# EasyEDA Pro project ProPrj_PomoDesk_V1.0.epro, board PCB_V1.0
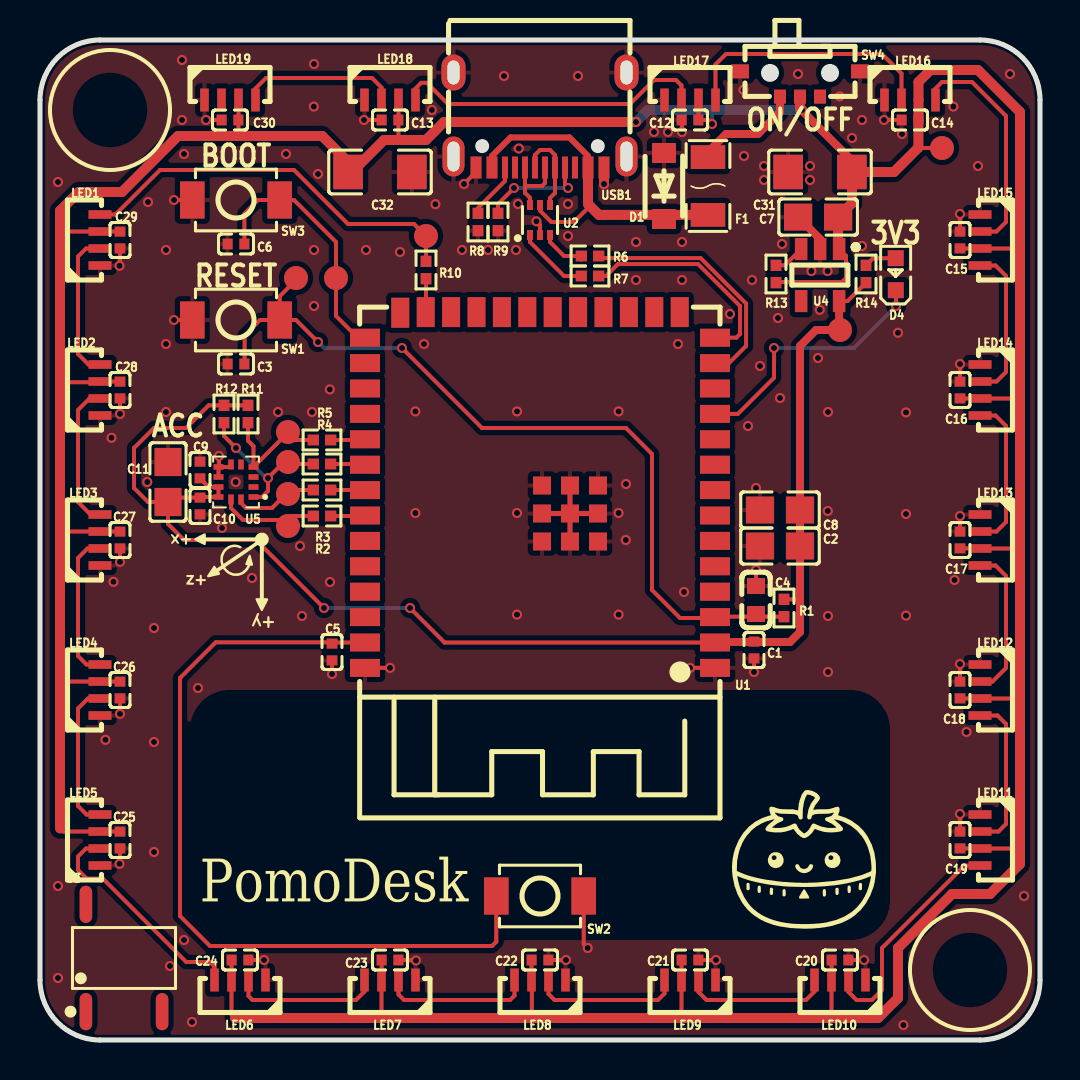
[diagram p7: board, top side]
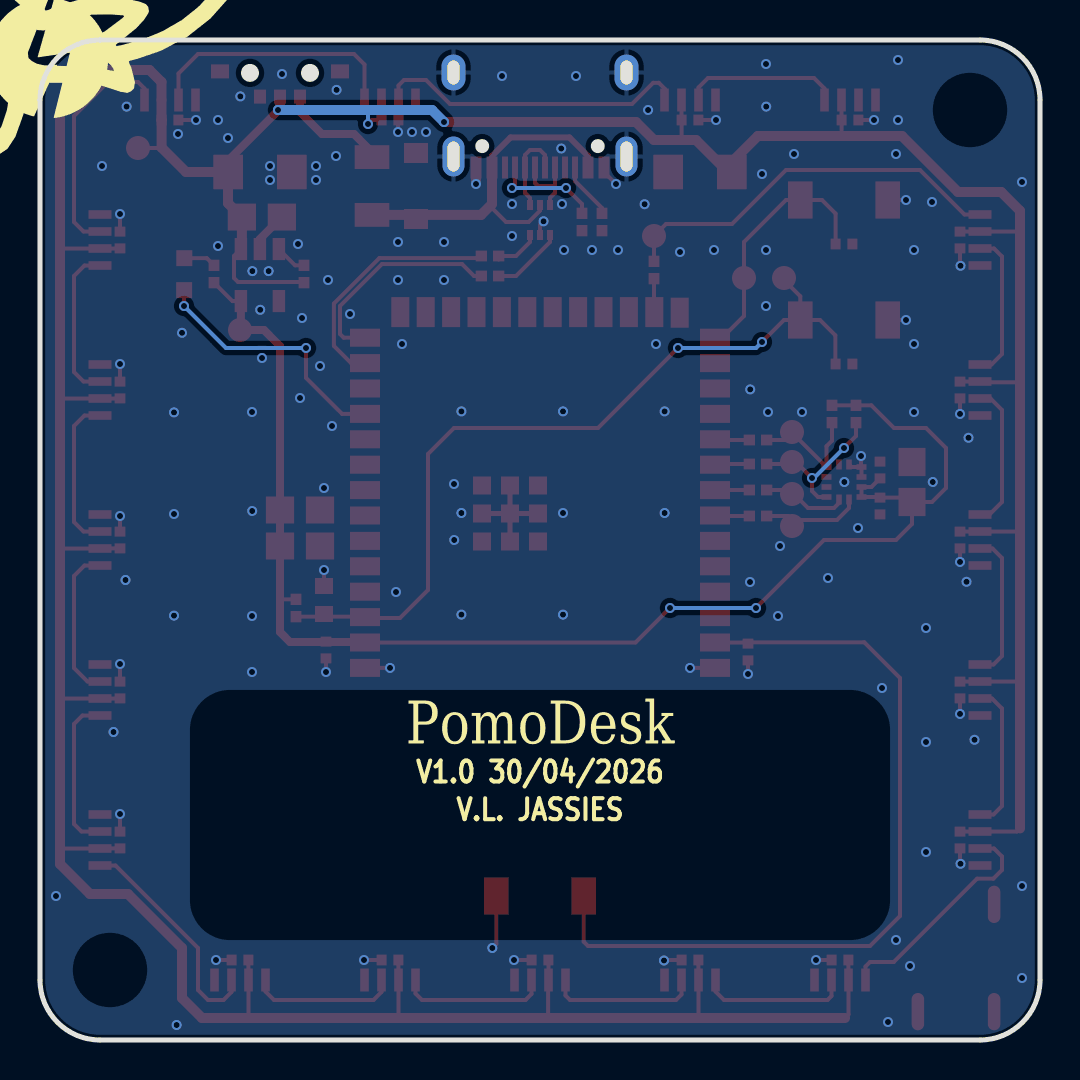
[diagram p8: board, bottom side, seen from below]

Outline 50 x 50 mm; copper layers: Top Layer, Bottom Layer. Coordinates in mm from the lower left corner of the outline.
Outline path: 0,47 0,3 arc(0.88,0.88) 3,0 47,0 arc(49.12,0.88) 50,3 50,47 arc(49.12,49.12) 47,50 3,50 arc(0.88,49.12) 0,47
Stack: Top Layer 0.035mm / Dielectric1 1.51mm FR4 er 4.5 / Bottom Layer 0.035mm

## Design rules (mm)
template: JLCPCB Capability(Two Layers Board)
spacing copperThickness1oz (default): track to track 0.102, other pairs 0.152 to 0.3
spacing copperThickness2oz: track to track 0.203, other pairs 0.152 to 0.3
track width copperThickness1oz (default): min 0.127, default 0.254, max 2.54
track width copperThickness2oz: min 0.203, default 0.254, max 2.54
differential pair differentialPair (default): width min 0.127, default 0.254, max 2.54; gap min 0.152, default 0.152
via viaSize (default): diameter min 0.5, default 0.61, max 10; hole min 0.3, default 0.305, max 6.3

## Placement (name value [footprint] x y rotation side)
C1  100nF  [C0402]  35.7 19.5 90 top
C2  10uF  [C0805]  37 24.7 0 top
C3  100nF  [C0402]  9.8 33.8 0 top
C4  1uF  [C0603]  35.8 22 270 top
C5  100nF  [C0402]  14.6 19.4 90 top
C6  100nF  [C0402]  9.8 39.8 0 top
C7  10uF  [C0805]  38.91 41.15 0 top
C8  10uF  [C0805]  37 26.5 0 top
C9  100nF  [C0402]  8 28.5 270 top
C10  100nF  [C0402]  8 26.7 90 top
C11  10uF  [C0805]  6.4 27.9 270 top
C12  100nF  [C0402]  32.5 46 0 top
C13  100nF  [C0402]  17.5 46 0 top
C14  100nF  [C0402]  43.5 46 0 top
C15  100nF  [C0402]  46 40 270 top
C16  100nF  [C0402]  46 32.5 270 top
C17  100nF  [C0402]  46 25 270 top
C18  100nF  [C0402]  46 17.5 270 top
C19  100nF  [C0402]  46 10 270 top
C20  100nF  [C0402]  40 4 180 top
C21  100nF  [C0402]  32.5 4 180 top
C22  100nF  [C0402]  25 4 180 top
C23  100nF  [C0402]  17.5 4 180 top
C24  100nF  [C0402]  10 4 180 top
C25  100nF  [C0402]  4 10 90 top
C26  100nF  [C0402]  4 17.5 90 top
C27  100nF  [C0402]  4 25 90 top
C28  100nF  [C0402]  4 32.5 90 top
C29  100nF  [C0402]  4 40 90 top
C30  100nF  [C0402]  9.5 46 0 top
C31  100uF  [C1206]  39 43.4 0 top
C32  100uF  [C1206]  17 43.4 180 top
D1  SMF5.0A  [SOD-123F_L2.8-W1.8-LS3.7-RD]  31.2 42.7 90 top
D4  GHC-YR1S2/6T  [LED0603-RD_GREEN]  42.79 38.29 90 top
F1  K1206L150AR  [F1206]  33.4 42.7 90 top
LED1  4020RGB-2812B  [LED-SMD_4P-L4.0-W1.7_XL-4020RGBC-WS2812B]  3 40 270 top
LED2  4020RGB-2812B  [LED-SMD_4P-L4.0-W1.7_XL-4020RGBC-WS2812B]  3 32.5 270 top
LED3  4020RGB-2812B  [LED-SMD_4P-L4.0-W1.7_XL-4020RGBC-WS2812B]  3 25 270 top
LED4  4020RGB-2812B  [LED-SMD_4P-L4.0-W1.7_XL-4020RGBC-WS2812B]  3 17.5 270 top
LED5  4020RGB-2812B  [LED-SMD_4P-L4.0-W1.7_XL-4020RGBC-WS2812B]  3 10 270 top
LED6  4020RGB-2812B  [LED-SMD_4P-L4.0-W1.7_XL-4020RGBC-WS2812B]  10 3 0 top
LED7  4020RGB-2812B  [LED-SMD_4P-L4.0-W1.7_XL-4020RGBC-WS2812B]  17.5 3 0 top
LED8  4020RGB-2812B  [LED-SMD_4P-L4.0-W1.7_XL-4020RGBC-WS2812B]  25 3 0 top
LED9  4020RGB-2812B  [LED-SMD_4P-L4.0-W1.7_XL-4020RGBC-WS2812B]  32.5 3 0 top
LED10  4020RGB-2812B  [LED-SMD_4P-L4.0-W1.7_XL-4020RGBC-WS2812B]  40 3 0 top
LED11  4020RGB-2812B  [LED-SMD_4P-L4.0-W1.7_XL-4020RGBC-WS2812B]  47 10 90 top
LED12  4020RGB-2812B  [LED-SMD_4P-L4.0-W1.7_XL-4020RGBC-WS2812B]  47 17.5 90 top
LED13  4020RGB-2812B  [LED-SMD_4P-L4.0-W1.7_XL-4020RGBC-WS2812B]  47 25 90 top
LED14  4020RGB-2812B  [LED-SMD_4P-L4.0-W1.7_XL-4020RGBC-WS2812B]  47 32.5 90 top
LED15  4020RGB-2812B  [LED-SMD_4P-L4.0-W1.7_XL-4020RGBC-WS2812B]  47 40 90 top
LED16  4020RGB-2812B  [LED-SMD_4P-L4.0-W1.7_XL-4020RGBC-WS2812B]  43.5 47 180 top
LED17  4020RGB-2812B  [LED-SMD_4P-L4.0-W1.7_XL-4020RGBC-WS2812B]  32.5 47 180 top
LED18  4020RGB-2812B  [LED-SMD_4P-L4.0-W1.7_XL-4020RGBC-WS2812B]  17.5 47 180 top
LED19  4020RGB-2812B  [LED-SMD_4P-L4.0-W1.7_XL-4020RGBC-WS2812B]  9.5 47 180 top
NOREF  -  [Pad_e10045]  12.4 27.3 0 top
NOREF#2  -  [Pad_e12603]  12.8 38.1 0 top
NOREF#3  -  [Pad_e12600]  14.8 38.1 0 top
NOREF#4  -  [Pad_e13775]  12.4 25.7 0 top
NOREF#5  -  [Pad_e11917]  19.3 40.2 0 top
NOREF#6  -  [Pad_e10046]  12.4 28.9 0 top
NOREF#7  -  [Pad_e9125]  45.1 44.6 270 top
NOREF#8  -  [Pad_e11690]  40 35.5 0 top
NOREF#9  -  [Pad_e10047]  12.4 30.4 0 top
R1  10kΩ  [R0402]  37.2 21.6 90 top
R2  0Ω  [R0402]  14.1 26.2 180 top
R3  0Ω  [R0402]  14.1 27.5 180 top
R4  0Ω  [R0402]  14.1 28.8 180 top
R5  0Ω  [R0402]  14.1 30 180 top
R6  22Ω  [R0402]  27.5 39.2 0 top
R7  22Ω  [R0402]  27.5 38.2 0 top
R8  5.1kΩ  [R0402]  21.9 40.9 90 top
R9  5.1kΩ  [R0402]  22.9 40.9 90 top
R10  220Ω  [R0402]  19.3 38.5 270 top
R11  10kΩ  [R0402]  10.4 31.3 90 top
R12  10kΩ  [R0402]  9.2 31.3 90 top
R13  10kΩ  [R0402]  36.8 38.3 270 top
R14  680Ω  [R0402]  41.3 38.3 270 top
SW1  TS-1088-AR02016  [SW-SMD_L3.9-W3.0-P4.45]  9.8 36 180 top
SW2  TS-1088-AR02016  [SW-SMD_L3.9-W3.0-P4.45]  25 7.2 0 top
SW3  TS-1088-AR02016  [SW-SMD_L3.9-W3.0-P4.45]  9.8 42 180 top
SW4  MK-11C04-G013  [SW-SMD_MK-11C04-G013]  38 47.8 180 top
U1  2.4GHz  [WIRELM-SMD_ESP32-S3-WROOM-1]  25 27.5 180 top
U2  USBLC6-2P6  [SOT-666-6_L1.6-W1.2-P0.50-LS1.6-BL]  25 41 0 top
U3  OC5022B  [ESOP-8_L4.9-W3.9-P1.27-LS6.0-BL-EP-1]  4.2 4.1 0 top
U4  AP2112K-3.3TRG1  [SOT-25-5_L2.9-W1.6-P0.95-LS2.8-BL]  39.01 38.25 180 top
U5  LIS2DW12TR  [LGA-12_L2.0-W2.0-P0.50-BL]  9.8 27.9 90 top
USB1  TYPE-C 16PIN 2MD(073)  [USB-C-SMD_TYPE-C-6PIN-2MD-073]  25 46 180 top

## Footprints (pads in the part's own frame, mm; a bottom-side part is the same pattern mirrored in y, then rotated)
C0402
  rect 0.5x0.54 smd: 1(-0.42,0) 2(0.42,0)
C0603
  rect 0.8x0.9 smd: 1(-0.7,0) 2(0.7,0)
C0805
  rect 1.41x1.35 smd: 1(-1,0) 2(1,0)
C1206
  rect 1.485x1.728 smd: 1(-1.593,0) 2(1.593,0)
ESOP-8_L4.9-W3.9-P1.27-LS6.0-BL-EP-1
  oval 0.63x1.865 smd: 1(-1.905,-2.683) 4(1.905,-2.683) 8(-1.905,2.683)
F1206
  rect 1.19x1.728 smd: 1(-1.445,0) 2(1.445,0)
LED0603-RD_GREEN
  rect 0.8x0.8 smd: 1(-0.799,-0.004) 2(0.799,0.004)
LED-SMD_4P-L4.0-W1.7_XL-4020RGBC-WS2812B
  rect 0.43x1.15 smd: 1(1.275,0) 2(0.425,0) 3(-0.425,0) 4(-1.275,0)
LGA-12_L2.0-W2.0-P0.50-BL
  rect 0.28x0.5 smd: 1(-0.75,-0.875) 2(-0.25,-0.875) 3(0.25,-0.875) 4(0.75,-0.875) 7(0.75,0.875) 8(0.25,0.875) 9(-0.25,0.875) 10(-0.75,0.875)
  rect 0.5x0.28 smd: 5(0.875,-0.25) 6(0.875,0.25) 11(-0.875,0.25) 12(-0.875,-0.25)
Pad_e9125
  round 1.2 smd: 1(0,0)
Pad_e10045
  round 1.2 smd: 1(0,0)
Pad_e10046
  round 1.2 smd: 1(0,0)
Pad_e10047
  round 1.2 smd: 1(0,0)
Pad_e11690
  round 1.2 smd: 1(0,0)
Pad_e11917
  round 1.2 smd: 1(0,0)
Pad_e12600
  round 1.2 smd: 1(0,0)
Pad_e12603
  round 1.2 smd: 1(0,0)
Pad_e13775
  round 1.2 smd: 1(0,0)
R0402
  rect 0.566x0.54 smd: 1(-0.433,0) 2(0.433,0)
SOD-123F_L2.8-W1.8-LS3.7-RD
  rect 1x1.2 smd: 1(-1.65,0) 2(1.65,0)
SOT-25-5_L2.9-W1.6-P0.95-LS2.8-BL
  rect 0.623x1.105 smd: 1(-0.95,-1.3) 2(-0.001,-1.3) 3(0.95,-1.3) 4(0.95,1.3) 5(-0.95,1.3)
SOT-666-6_L1.6-W1.2-P0.50-LS1.6-BL
  rect 0.3x0.5 smd: 1(-0.5,-0.75) 2(0,-0.75) 3(0.5,-0.75) 4(0.5,0.75) 5(0,0.75) 6(-0.5,0.75)
SW-SMD_L3.9-W3.0-P4.45
  rect 1.23x1.86 smd: 1(-2.185,0) 2(2.185,0)
SW-SMD_MK-11C04-G013
  rect 0.6x0.7 smd: 1(-1,0.63) 2(1,0.63) C(0,0.63)
  rect 0.9x0.7 smd: 4(3,-0.63) 5(-3,-0.63)
USB-C-SMD_TYPE-C-6PIN-2MD-073
  rect 0.55x1.1 smd: 1(-3.2,2.375) 2(-2.4,2.375) 11(2.4,2.375) 12(3.2,2.375)
  rect 0.3x1.1 smd: 3(-1.75,2.375) 4(-1.25,2.375) 5(-0.75,2.375) 6(-0.25,2.375) 7(0.25,2.375) 8(0.75,2.375) 9(1.25,2.375) 10(1.75,2.375)
  oval 1.1x2 hole 0.6x1.5: 13(-4.325,1.825) 14(4.325,1.825)
  oval 1.2x1.8 hole 0.6x1.2: 13(-4.325,-2.375) 14(4.325,-2.375)
WIRELM-SMD_ESP32-S3-WROOM-1
  rect 1.5x0.9 smd: 1(-8.75,8.895) 2(-8.75,7.625) 3(-8.75,6.355) 4(-8.75,5.085) 5(-8.75,3.815) 6(-8.75,2.545) 7(-8.75,1.275) 8(-8.75,0.005) 9(-8.75,-1.265) 10(-8.75,-2.535) 11(-8.75,-3.805) 12(-8.75,-5.075) 13(-8.75,-6.345) 14(-8.75,-7.615) 27(8.75,-7.615) 28(8.75,-6.345) 29(8.75,-5.075) 30(8.75,-3.805) 31(8.75,-2.535) 32(8.75,-1.265) 33(8.75,0.005) 34(8.75,1.275) 35(8.75,2.545) 36(8.75,3.815) 37(8.75,5.085) 38(8.75,6.355) 39(8.75,7.625) 40(8.75,8.895)
  rect 0.9x1.5 smd: 15(-6.985,-8.895) 16(-5.715,-8.895) 17(-4.445,-8.895) 18(-3.175,-8.895) 19(-1.905,-8.895) 20(-0.635,-8.895) 21(0.635,-8.895) 22(1.905,-8.895) 23(3.175,-8.895) 24(4.445,-8.895) 25(5.715,-8.895) 26(6.985,-8.865)
  rect 0.9x0.9 smd: 41(-2.9,2.575) 41(-2.9,1.175) 41(-2.9,-0.225) 41(-1.5,2.575) 41(-1.5,1.175) 41(-1.5,-0.225) 41(-0.1,2.575) 41(-0.1,1.175) 41(-0.1,-0.225)

## Nets
As in the schematic, except:
+3V3: C1.2 C2.2 C8.2 C9.2 C10.2 C11.2 NOREF#8.1 R1.2 R11.2 R12.2 R14.2 U1.2 U4.5 U5.9 U5.10
+5V: C7.2 C12.2 C13.2 C14.2 C15.2 C16.2 C17.2 C18.2 C19.2 C20.2 C21.2 C22.2 C23.2 C24.2 C25.2 C26.2 C27.2 C28.2 C29.2 C30.2 C31.2 C32.2 LED1.3 LED2.3 LED3.3 LED4.3 LED5.3 LED6.3 LED7.3 LED8.3 LED9.3 LED10.3 LED11.3 LED12.3 LED13.3 LED14.3 LED15.3 LED16.3 LED17.3 LED18.3 LED19.3 NOREF#7.1 R13.2 SW4.C U4.1
ACC_INT1: NOREF.1 R3.2 U5.12
ACC_INT2: NOREF#4.1 R2.2 U5.11
BOOT: C6.2 NOREF#3.1 SW3.1 U1.27
EN: C3.2 C4.2 NOREF#2.1 R1.1 SW1.1 U1.3
I2C_SCL: NOREF#6.1 R4.2 R12.1 U5.1
I2C_SDA: NOREF#9.1 R5.2 R11.1 U5.4
RGB_CTRL: LED1.4 NOREF#5.1 R10.1

Pads without a net: LED19 2; SW4 1; U1 4 5 6 7 8 9 10 12 15 16 17 18 19 20 21 22 23 24 26 28 29 30 35 36 37 38; U3 1 4 8; U4 4; U5 2 3 5; USB1 3 9

## Via types
v1: diameter 0.5, hole 0.305, Top Layer to Bottom Layer, 151 vias

## Routing (per net, layer and track width the routed paths; a pad name or vN(x,y) marks a point on that pad's centre or on a via; arc(x,y) is an arc through that point)
+3V3: length 70.8
  Top Layer w0.2: R1.2 38,22.03 38,22.03 ; C9.2 8.43,27.65 U5.9 U5.10 8.03,27.15 C10.2 6.62,27.12 C11.2 ; v1(14.2,21.6) 10.8,25 7.2,25 6.4,25.8 C11.2 ; R11.2 R12.2 8.43,31.73 7.3,30.6 5.7,30.6 4.7,29.6 4.7,27.6 5.4,26.9 C11.2 ; v1(18.5,21.6) 20.22,19.88 U1.2 ; U4.5 40.38,36.95 41.3,37.87
  Top Layer w0.4: U1.2 33.78,19.9 37.5,19.9 38,20.4 C2.2 C8.2 38,34.7 38.8,35.5 NOREF#8.1 39.96,35.54 U4.5
  Bottom Layer w0.2: v1(18.5,21.6) v1(14.2,21.6)
+5V: length 232.8
  Top Layer w0.2: C23.2 17.08,3 LED7.3 17.07,1.16 17.13,1.1 ; C25.2 4,10.42 LED5.3 1.16,10.42 1,10.58 ; 36.8,37.87 36.83,37.9 40.1,37.9 40.3,38.1 40.3,39.2 U4.1 ; 1,40.42 1,40.42 LED1.3 4,40.42 C29.2 ; 49,9.61 48.96,9.58 LED11.3 47,9.58 C19.2 ; 9.92,45.5 C30.2 9.93,46 LED19.3 ; C28.2 4,32.92 LED2.3 2.96,32.89 1,32.89 ; C27.2 4,25.42 LED3.3 1.07,25.42 1,25.5 ; C21.2 32.08,3 LED9.3 32.07,1.11 32.09,1.1 ; 24.59,1.1 24.59,2.98 LED8.3 24.57,4 C22.2 ; 49,32.09 48.99,32.08 LED14.3 46,32.08 C16.2 ; 39.61,1.1 39.57,1.13 LED10.3 39.58,3 C20.2 ; LED18.3 17.93,46 C13.2 17.92,45.08 17.84,45 ; 49,17.06 48.99,17.08 LED12.3 46,17.08 C18.2 ; 1,17.93 1.01,17.92 LED4.3 4,17.92 C26.2 ; NOREF#7.1 43.94,44.6 43.92,44.62 ; C17.2 47,24.58 LED13.3 49,24.58 ; 49,39.57 49,39.58 LED15.3 46,39.58 C15.2 ; v1(33.6,45.8) 33.4,46 C12.2 32.93,46 LED17.3 ; C24.2 9.58,3 LED6.3 9.57,1.27 9.75,1.1
  Top Layer w0.4: 38.06,46.5 40.6,43.97 40.6,43.35
  Top Layer w0.5: 39.96,39.65 39.91,39.7 C7.2 40.6,41.84 40.6,43.35 ; v1(29.8,45.9) 20.2,45.9 19.3,45 17.2,45 15.6,43.4 C32.2 15.41,43.9 14.11,45.2 6.9,45.2 4.1,42.4 1.94,42.4 1,41.46 1,10.58 ; v1(38.1,46.5) 38.06,46.5 38,46.56 SW4.C ; 40.6,43.4 42.7,43.4 43.92,44.62 C14.2 43.93,46 LED16.3 43.93,47.9 44.53,48.5 46.9,48.5 49,46.4 49,8.8 47.5,7.3 45.6,7.3 42.9,4.6 42.9,2.1 41.9,1.1 9.75,1.1
  Bottom Layer w0.2: 33.56,46.5 33.6,46.45 v1(33.6,45.8)
  Bottom Layer w0.5: v1(38.1,46.5) 30.4,46.5 v1(29.8,45.9)
GND: length 36.7
  Top Layer w0.2: U2.2 25,40.76 v1(24.82,40.93) ; C1.1 v1(35.7,18.4) ; C13.1 v1(16.2,46) ; C4.1 v1(35.8,23.5) ; 14.6,18.88 v1(14.6,18.3) ; U5.8 U5.7 ; U5.7 9.43,28.65 U5.6 ; U5.7 8.95,28.67 v1(8.95,29.2) ; v1(3.97,8.81) 4,8.83 C25.1 ; C26.1 v1(4,16.31) ; C27.1 v1(4,23.91) ; C30.1 v1(8.3,46) ; C19.1 v1(46,11.3) ; C12.1 32.1,45.98 v1(32.1,45.4) ; v1(18.8,3.97) 18.78,4 C23.1 ; C14.1 v1(42.2,46) ; C18.1 v1(46,18.8) ; U1.1 v1(32.5,18.61) ; v1(27.38,4.6) 27.19,4.8 SW2.2 ; USB1.12 21.8,43.4 v1(21.2,42.8) ; C24.1 v1(11.2,4) ; C29.1 4,38.73 v1(3.97,38.71) ; C17.1 v1(46,26.2) ; C20.1 v1(41.2,4) ; SW1.2 v1(6.7,36) ; C28.1 v1(4,31.31) ; SW3.2 v1(6.7,42) ; U1.40 v1(17.5,18.61) ; C15.1 v1(46,41.3) ; C22.1 v1(26.3,4) ; C16.1 v1(46,33.8) ; C21.1 v1(33.8,4)
  Top Layer w0.254: U1.41 U1.41 ; U1.41 U1.41 ; U1.41 U1.41 ; U1.41 U1.41
  Top Layer w0.4: 39.01,39.55 39.01,40.05 C7.1
  Top Layer w0.5: USB1.1 v1(28.2,42.8)
  vias: v1(0.9,42.9) v1(0.9,7.7) v1(0.9,3.1) v1(3.28,15.01) v1(3.58,30.11) v1(3.67,22.91) v1(5.4,41.9) v1(5.36,27.9) v1(5.7,20.6) v1(5.7,14.9) v1(5.7,9.4) v1(6.3,39.5) v1(6.3,34.8) v1(6.3,31.4) v1(6.5,3.7) v1(7.1,49) v1(7.1,46) v1(7.2,44.3) v1(7.2,5) v1(7.6,0.9) v1(7.9,17.6) v1(9.1,25.6) v1(9.78,27.9) v1(10.6,23.1) v1(11.9,31.4) v1(12.3,44.3) v1(13,24.7) v1(13.1,21.2) v1(13.6,31.4) v1(13.7,48.8) v1(13.69,46.67) v1(13.7,39.5) v1(13.7,36.7) v1(13.9,43.3) v1(14.49,32.53) v1(14.5,22.9) v1(16.3,39.5) v1(18,39.4) v1(18.77,31.43) v1(18.77,26.35) v1(19.2,34.8) v1(19.59,46.5) v1(19.77,41.79) v1(21.1,39.5) v1(22.4,39.5) v1(23.2,48.2) v1(23.8,39.5) v1(23.85,31.43) v1(23.85,26.35) v1(23.85,21.27) v1(23.94,44.58) v1(23.9,41.8) v1(26.4,41.8) v1(26.4,40.2) v1(26.9,48.2) v1(28.93,31.43) v1(28.93,26.35) v1(28.93,21.27) v1(29.3,27.8) v1(29.29,25) v1(29.8,39.9) v1(29.8,38) v1(30.7,45.4) v1(31.4,45.4) v1(31.9,34.8) v1(32.1,39.9) v1(32.1,38) v1(32.2,22.4) v1(34.5,36.3) v1(35.17,47.5) v1(35.2,44.2) v1(35.4,30.7) v1(35.6,38) v1(35.8,27.6) v1(36,33.7) v1(36.2,43.7) v1(36.2,43) v1(36.9,36.1) v1(37,32.1) v1(37.1,39.8) v1(37.9,48.3) v1(38.5,43.7) v1(38.5,43) v1(38.57,38.45) v1(38.9,34.1) v1(38.99,36.51) v1(39.38,38.45) v1(39.4,31.4) v1(39.39,26.45) v1(39.4,21.2) v1(39.4,18.4) v1(39.98,47.18) v1(40.6,45.1) v1(41.1,46) v1(41.1,39.7) v1(42.9,35.36) v1(43.1,45.3) v1(43.17,0.75) v1(43.3,31.38) v1(43.3,26.3) v1(43.3,21.22) v1(45.67,46.67) v1(45.72,23) v1(46.32,15.4) v1(46.9,43.7) v1(48.5,48.3) v1(49.2,7.2)
VBUS: length 18.2
  Top Layer w0.2: U2.5 25,41.47 25.57,40.9 26.7,40.9 27.4,41.6 27.4,41.8
  Top Layer w0.3: USB1.11 22.6,44.2 23.53,45.13 26.47,45.13 27.4,44.2 USB1.2
  Top Layer w0.5: USB1.2 27.4,41.8 27.94,41.25 F1.1
VIN: length 5.5
  Top Layer w0.4: SW4.2 37,46.4 35.9,45.3 34.3,45.3 33.4,44.4 F1.2
ACC_INT1: length 4.3
  Top Layer w0.2: U5.12 10.05,26.85 10.3,26.6 11.6,26.6 12.5,27.5 R3.2
ACC_INT2: length 4.9
  Top Layer w0.2: U5.11 9.55,26.6 10.15,26 12.4,26 12.6,26.2 R2.2
BOOT: length 12.9
  Top Layer w0.2: C6.2 10.22,41.32 10.9,42 SW3.1 12.7,42 14.8,39.9 NOREF#3.1 14.8,36.2 15.88,35.11 U1.27
EN: length 41.4
  Top Layer w0.2: SW1.1 11.99,37.19 12.9,38.1 ; SW1.1 12.8,36 v1(13.9,34.9) ; SW1.1 11,36 10.23,35.23 10.23,33.8 ; v1(18.1,34.6) 22.1,30.6 29.3,30.6 30.6,29.3 30.6,22.5 32,21.1 33.71,21.1 U1.3 33.77,21.17 37.2,21.17
  Bottom Layer w0.2: v1(13.9,34.9) 14.2,34.6 v1(18.1,34.6)
I2C_SCL: length 7.8
  Top Layer w0.2: R4.2 12.1,28.8 v1(11.4,28.1) 11.4,27.45 11.1,27.15 U5.1 ; v1(9.8,29.6) 9.2,30.2 9.2,30.87
  Bottom Layer w0.2: v1(9.8,29.6) 11.3,28.1 v1(11.4,28.1)
I2C_SDA: length 6
  Top Layer w0.2: R5.2 12.6,30 12.4,30.2 12.22,30.2 U5.4 10.68,29.69 10.4,29.96 10.4,30.87
INPUT_BUTTON: length 40.8
  Top Layer w0.2: SW2.1 22.81,4.92 22.6,4.7 8.5,4.7 7,6.2 7,18.1 8.78,19.89 14.44,19.89 14.6,19.72 14.75,19.88 U1.39
PWR_LED: length 13
  Top Layer w0.2: v1(42.8,36.7) 42.8,37.48 D4.1 ; U1.11 34.9,31.31 36.7,33.11 36.7,33.79 36.7,33.79 36.7,34.21 36.7,34.21 v1(36.7,34.6)
  Bottom Layer w0.2: v1(36.7,34.6) 38.69,34.6 38.69,34.6 39.11,34.6 39.11,34.6 40.7,34.6 v1(42.8,36.7)
RGB_CTRL: length 19.9
  Top Layer w0.2: R10.1 NOREF#5.1 18.7,40.8 15.4,40.8 12.7,43.5 6,43.5 3.78,41.28 LED1.4
USB_D+: length 10.9
  Top Layer w0.2: R7.2 28.3,38.2 28.9,38.8 32.9,38.8 35,36.7 35,36.51 35,36.51 35,36.09 35,36.09 35,35.3 34.81,35.11 U1.14
USB_D-: length 12.4
  Top Layer w0.2: R6.2 27.93,39.2 28.03,39.1 33.03,39.1 35.3,36.82 35.3,34.7 34.44,33.84 U1.13
USB_DN: length 4.4
  Top Layer w0.2: U2.4 25.5,42.1 25.75,42.35 USB1.5 25.75,44.25 25.5,44.5 25,44.5 24.75,44.25 USB1.7
USB_DP: length 3.8
  Top Layer w0.2: U2.6 24.5,42.11 24.25,42.36 24.25,42.7 ; 24.25,42.7 24.25,42.7 25.1,42.7 25.25,42.85 USB1.6 ; 24.25,42.7 USB1.8
$1N18730: length 2.8
  Top Layer w0.2: USB1.10 23.25,42.95 21.9,41.6 21.9,41.43
$1N18731: length 5.3
  Top Layer w0.2: 22.9,41.43 22.9,41.8 v1(23.7,42.6) ; USB1.4 26.25,42.75 v1(26.4,42.6)
  Bottom Layer w0.2: v1(23.7,42.6) v1(26.4,42.6)
$1N24247: length 1.7
  Top Layer w0.2: U1.25 19.3,36.41 R10.2
$1N24410: length 1.7
  Top Layer w0.2: U1.33 16.25,27.5 R3.1
$1N24494: length 1.7
  Top Layer w0.2: R4.1 16.22,28.8 U1.32
$1N24537: length 1.7
  Top Layer w0.2: U1.31 16.22,30 R5.1
$1N28130: length 1.6
  Top Layer w0.2: R13.1 37.24,38.73 U4.3
$1N28194: length 2.4
  Top Layer w0.2: U2.3 25.5,39.9 26.2,39.2 26.9,39.2 27.07,39.03 R6.1
$1N28239: length 3.6
  Top Layer w0.2: U2.1 24.5,39.9 26.2,38.2 R7.1
$1N30261: length 1.7
  Top Layer w0.2: U1.34 16.22,26.2 R2.1
$1N32916: length 1.6
  Top Layer w0.2: R14.1 41.66,39.09 42.78,39.09
$2N12529: length 7.5
  Top Layer w0.2: LED2.4 2.42,33.78 1.9,34.3 1.9,39.17 2.3,39.58 LED1.2
$2N12799: length 7.3
  Top Layer w0.2: LED2.2 2.47,32.08 1.9,31.5 1.9,26.9 2.53,26.28 LED3.4
$2N13050: length 7.5
  Top Layer w0.2: LED4.4 2.33,18.78 1.9,19.2 1.9,24.1 2.38,24.58 LED3.2
$2N13066: length 7.5
  Top Layer w0.2: LED5.4 2.33,11.28 1.9,11.7 1.9,16.58 2.4,17.08 LED4.2
$2N13318: length 11.4
  Top Layer w0.2: LED6.4 8.72,3.67 8.5,3.9 7.31,3.9 3.14,8.07 2.33,8.07 1.9,8.5 1.9,9.17 2.3,9.58 LED5.2
$2N13334: length 7.4
  Top Layer w0.2: LED6.2 10.43,2.2 10.62,2 15.8,2 16.22,2.42 LED7.4
$2N13586: length 7.5
  Top Layer w0.2: LED7.2 17.93,2.28 18.2,2 23.5,2 23.72,2.22 LED8.4
$2N13602: length 7.4
  Top Layer w0.2: LED8.2 25.43,2.3 25.72,2 30.9,2 31.22,2.33 LED9.4
$2N14526: length 7.3
  Top Layer w0.2: LED9.2 32.93,2.4 33.32,2 38.3,2 38.72,2.42 LED10.4
$2N14542: length 11.4
  Top Layer w0.2: LED10.2 40.43,2.4 40.82,2 41.6,2 42.1,2.5 42.1,4.6 46.22,8.72 LED11.4
$2N14558: length 7.9
  Top Layer w0.2: LED12.4 47.88,16.22 48.3,15.8 48.3,10.8 47.93,10.42 LED11.2
$2N14574: length 7.7
  Top Layer w0.2: LED13.4 47.78,23.72 48.3,23.2 48.3,18.6 47.62,17.92 LED12.2
$2N14590: length 7.8
  Top Layer w0.2: LED13.2 47.82,25.42 48.3,25.9 48.3,30.7 47.78,31.22 LED14.4
$2N14606: length 7.8
  Top Layer w0.2: LED14.2 47.82,32.92 48.3,33.4 48.3,38.2 47.78,38.72 LED15.4
$2N14622: length 11.7
  Top Layer w0.2: LED15.2 47.82,40.42 48.3,40.9 48.3,46.2 46.6,47.9 45.1,47.9 44.78,47.58 LED16.4
$2N14638: length 13
  Top Layer w0.2: LED17.4 33.78,48.78 34.3,49.3 42.1,49.3 43.07,48.33 LED16.2
$2N15567: length 15.8
  Top Layer w0.2: LED18.4 18.76,47.02 18.76,47.56 19.06,47.86 19.34,47.86 20.4,46.8 29.5,46.8 30.7,48 31.8,48 32.07,47.72 LED17.2
$2N15583: length 7.9
  Top Layer w0.2: LED18.2 17.07,47.62 16.6,48.1 11.3,48.1 10.78,47.58 LED19.4

## Copper pours and planes (outline as drawn; the poured copper is in the pictures)
GND on Top Layer: -9.7,56.6 55.3,56.6 55.3,-8.4 -9.7,-8.4
GND on Bottom Layer: -1,51 62,51 62,-10 -1,-10

## Text on the board
Bottom Silkscreen Layer: V1.0 30/04/2026 | V.L. JASSIES | PomoDesk
Top Silkscreen Layer: ACC | BOOT | RESET | ON/OFF | 3V3 | PomoDesk
